# Altium schematic sheet webench_design_4015146_2_ad14_sim.SchDoc
size A3; Parameter0: 3m; Parameter1: 0.005; Parameter2: 40; Parameter3: 10u; Parameter4: 200; Parameter5: 5n; Parameter6: 5n; Parameter7: 10n; Parameter8: 200; Parameter9: 0; Parameter10: 1f; Parameter11: 40; Parameter12: off; Parameter13: true; Parameter14: 1000000000; Parameter15: 1; Parameter16: 1; Parameter17: false; Parameter18: false; Parameter19: pspice
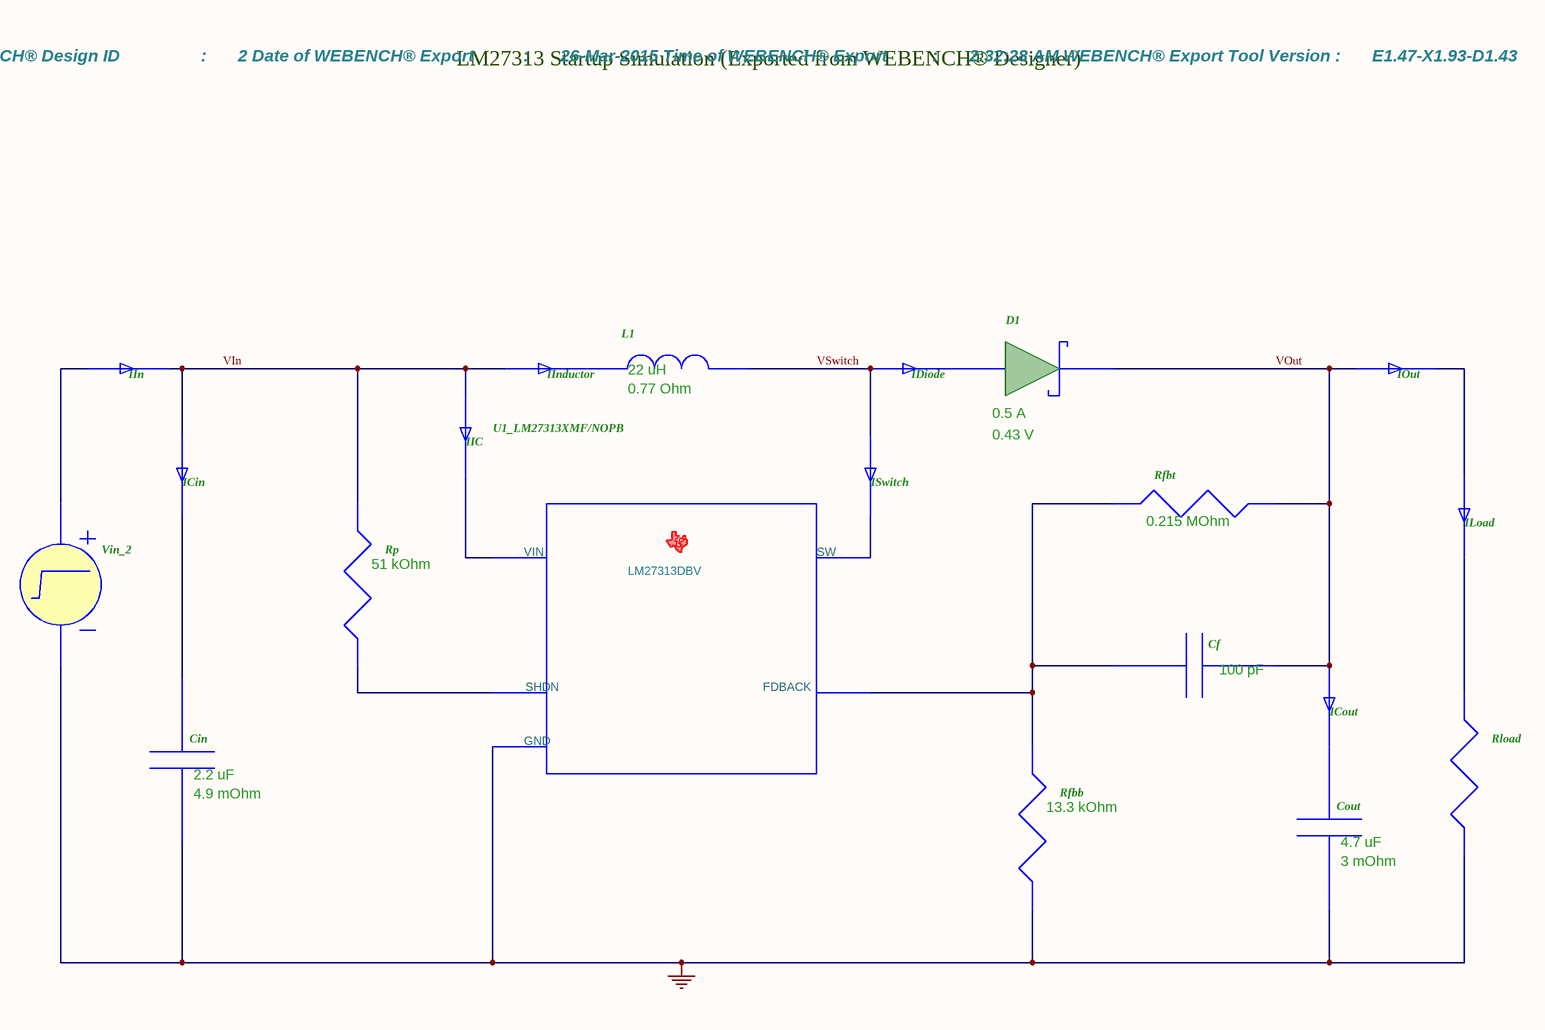
[diagram p0: webench_design_4015146_2_ad14_sim.SchDoc]

## Parts
Cf  (no value)
Cin  (no value)
Cout  (no value)
D1  (no value)
ICin  (no value)
ICout  (no value)
IDiode  (no value)
IIC  (no value)
IIn  (no value)
IInductor  (no value)
ILoad  (no value)
IOut  (no value)
ISwitch  (no value)
L1  (no value)
Rfbb  (no value)
Rfbt  (no value)
Rload  (no value)
Rp  (no value)
U1_LM27313XMF/NOPB  (no value)
Vin_2  (no value)

## Nets
GND: Cin.2 Cout.4 Rfbb.0 Rload.2 U1_LM27313XMF/NOPB.GND Vin_2.2
VIn: ICin.2 IIC.2 IIn.2 IInductor.1 Rp.1
VOut: Cf.6 D1.K ICout.2 IOut.1 Rfbt.6
VSwitch: IDiode.1 ISwitch.2 L1.2
NetCf_5: Cf.5 Rfbb.5 Rfbt.5 U1_LM27313XMF/NOPB.FDBACK
NetCin_1: Cin.1 ICin.1
NetCout_2: Cout.2 ICout.1
NetD1_A: D1.A IDiode.2
NetIIC_1: IIC.1 U1_LM27313XMF/NOPB.VIN
NetIIn_1: IIn.1 Vin_2.1
NetIInductor_2: IInductor.2 L1.1
NetILoad_1: ILoad.1 Rload.1
NetILoad_2: ILoad.2 IOut.2
NetISwitch_1: ISwitch.1 U1_LM27313XMF/NOPB.SW
NetRp_2: Rp.2 U1_LM27313XMF/NOPB.SHDN

## Notes on the sheet
- LM27313 Startup Simulation
  (Exported from WEBENCH® Designer)
- Title :    LM27313XMF/NOPB 4.5V-5.5V to 21.00V @
  0.032A
  -------------------------------------------------------------------------
  WEBENCH® User ID                      :       4015146
  WEBENCH® Design ID                  :       2
  Date of WEBENCH® Export           :       26-Mar-2015
  Time of WEBENCH® Export          :       2:32:28 AM
  WEBENCH® Export Tool Version :       E1.47-X1.93-D1.43
- L1
- (near D1) D1
- (near IIn) IIn
- IInductor
- IDiode
- (near IOut) IOut
- (near ICin) ICin
- (near IIC) IIC
- (near IIC) U1_LM27313XMF/NOPB
- (near ISwitch) ISwitch
- (near Rfbt) Rfbt
- (near ILoad) ILoad
- Vin_2
- (near Rp) Rp
- (near Cf) Cf
- (near Cin) Cin
- (near ICout) ICout
- (near Rload) Rload
- (near Rfbb) Rfbb
- (near Cout) Cout
- (in symbol Cf) 100 pF
- (in symbol Cin) 2.2 uF; 4.9 mOhm
- (in symbol Cout) 4.7 uF; 3 mOhm
- (in symbol D1) 0.5 A; 0.43 V
- (in symbol L1) 22 uH; 0.77 Ohm
- (in symbol Rfbb) 13.3 kOhm
- (in symbol Rfbt) 0.215 MOhm
- (in symbol Rp) 51 kOhm
- (in symbol U1_LM27313XMF/NOPB) LM27313DBV

## Library data of the parts
Cf = Cf
Cin = Cin
Cout = Cout
D1 = D1
ICin = ICin: VALUE: 0
ICout = ICout: VALUE: 0
IDiode = IDiode: VALUE: 0
IIC = IIC: VALUE: 0
IIn = IIn: VALUE: 0
IInductor = IInductor: VALUE: 0
ILoad = ILoad: VALUE: 0
IOut = IOut: VALUE: 0
ISwitch = ISwitch: VALUE: 0
L1 = L1
Rfbb = Rfbb
Rfbt = Rfbt
Rload = Rload
Rp = Rp
U1_LM27313XMF/NOPB = U1_LM27313XMF/NOPB
Vin_2 = Vin_2